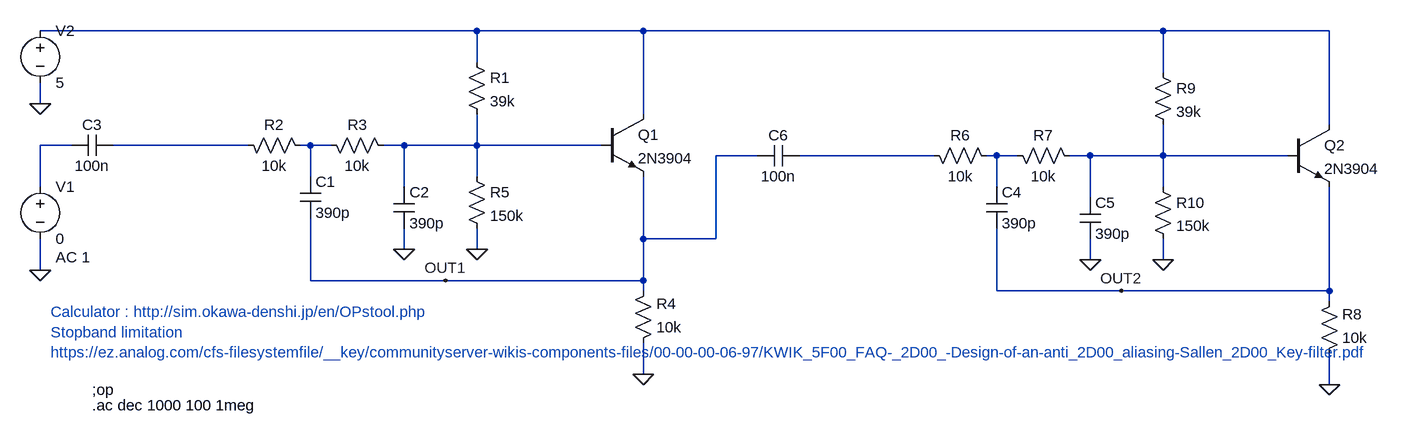
[diagram p0: schematic filter4.asc]
filter4.asc, the LTspice schematic file:
Version 4
SHEET 1 2504 680
WIRE 592 -176 -80 -176
WIRE 848 -176 592 -176
WIRE 1648 -176 848 -176
WIRE 1904 -176 1648 -176
WIRE 592 -128 592 -176
WIRE 1648 -112 1648 -176
WIRE -80 -64 -80 -96
WIRE 848 -48 848 -176
WIRE 1904 -32 1904 -176
WIRE -32 0 -80 0
WIRE 240 0 32 0
WIRE 336 0 320 0
WIRE 368 0 336 0
WIRE 480 0 448 0
WIRE 592 0 592 -48
WIRE 592 0 480 0
WIRE 784 0 592 0
WIRE 1024 16 960 16
WIRE 1296 16 1088 16
WIRE 1392 16 1376 16
WIRE 1424 16 1392 16
WIRE 1536 16 1504 16
WIRE 1648 16 1648 -32
WIRE 1648 16 1536 16
WIRE 1840 16 1648 16
WIRE 336 48 336 0
WIRE 592 48 592 0
WIRE -80 64 -80 0
WIRE 480 64 480 0
WIRE 1392 64 1392 16
WIRE 1648 64 1648 16
WIRE 1536 80 1536 16
WIRE 848 144 848 48
WIRE 960 144 960 16
WIRE 960 144 848 144
WIRE 480 160 480 128
WIRE 592 160 592 128
WIRE 1536 176 1536 144
WIRE 1648 176 1648 144
WIRE -80 192 -80 144
WIRE 336 208 336 112
WIRE 544 208 336 208
WIRE 848 208 848 144
WIRE 848 208 544 208
WIRE 848 224 848 208
WIRE 1392 224 1392 128
WIRE 1584 224 1392 224
WIRE 1904 224 1904 64
WIRE 1904 224 1584 224
WIRE 1904 240 1904 224
WIRE 848 352 848 304
WIRE 1904 368 1904 320
FLAG -80 -64 0
FLAG -80 192 0
FLAG 480 160 0
FLAG 848 352 0
FLAG 592 160 0
FLAG 1536 176 0
FLAG 1904 368 0
FLAG 1648 176 0
FLAG 544 208 OUT1
FLAG 1584 224 OUT2
DATAFLAG 736 208 ""
DATAFLAG 160 0 ""
DATAFLAG 1792 224 ""
DATAFLAG 1216 16 ""
DATAFLAG 672 0 ""
DATAFLAG 1760 16 ""
SYMBOL voltage -80 48 R0
WINDOW 123 24 124 Left 2
WINDOW 39 0 0 Left 0
SYMATTR Value2 AC 1
SYMATTR InstName V1
SYMATTR Value 0
SYMBOL npn 784 -48 R0
SYMATTR InstName Q1
SYMATTR Value 2N3904
SYMBOL res 224 -16 M90
WINDOW 0 0 56 VBottom 2
WINDOW 3 32 56 VTop 2
SYMATTR InstName R2
SYMATTR Value 10k
SYMBOL res 352 -16 M90
WINDOW 0 0 56 VBottom 2
WINDOW 3 32 56 VTop 2
SYMATTR InstName R3
SYMATTR Value 10k
SYMBOL res 832 320 M180
WINDOW 0 36 76 Left 2
WINDOW 3 36 40 Left 2
SYMATTR InstName R4
SYMATTR Value 10k
SYMBOL cap 320 48 R0
SYMATTR InstName C1
SYMATTR Value 390p
SYMBOL cap 464 64 R0
SYMATTR InstName C2
SYMATTR Value 390p
SYMBOL voltage -80 -192 R0
SYMATTR InstName V2
SYMATTR Value 5
SYMBOL res 576 -144 R0
SYMATTR InstName R1
SYMATTR Value 39k
SYMBOL res 576 32 R0
SYMATTR InstName R5
SYMATTR Value 150k
SYMBOL cap 32 -16 R90
WINDOW 0 0 32 VBottom 2
WINDOW 3 32 32 VTop 2
SYMATTR InstName C3
SYMATTR Value 100n
SYMBOL npn 1840 -32 R0
SYMATTR InstName Q2
SYMATTR Value 2N3904
SYMBOL res 1280 0 M90
WINDOW 0 0 56 VBottom 2
WINDOW 3 32 56 VTop 2
SYMATTR InstName R6
SYMATTR Value 10k
SYMBOL res 1408 0 M90
WINDOW 0 0 56 VBottom 2
WINDOW 3 32 56 VTop 2
SYMATTR InstName R7
SYMATTR Value 10k
SYMBOL res 1888 336 M180
WINDOW 0 36 76 Left 2
WINDOW 3 36 40 Left 2
SYMATTR InstName R8
SYMATTR Value 10k
SYMBOL cap 1376 64 R0
SYMATTR InstName C4
SYMATTR Value 390p
SYMBOL cap 1520 80 R0
SYMATTR InstName C5
SYMATTR Value 390p
SYMBOL res 1632 -128 R0
SYMATTR InstName R9
SYMATTR Value 39k
SYMBOL res 1632 48 R0
SYMATTR InstName R10
SYMATTR Value 150k
SYMBOL cap 1088 0 R90
WINDOW 0 0 32 VBottom 2
WINDOW 3 32 32 VTop 2
SYMATTR InstName C6
SYMATTR Value 100n
TEXT 0 376 Left 2 !;op
TEXT 0 400 Left 2 !.ac dec 1000 100 1meg
TEXT -64 256 Left 2 ;Calculator : http://sim.okawa-denshi.jp/en/OPstool.php\nStopband limitation\nhttps://ez.analog.com/cfs-filesystemfile/__key/communityserver-wikis-components-files/00-00-00-06-97/KWIK_5F00_FAQ-_2D00_-Design-of-an-anti_2D00_aliasing-Sallen_2D00_Key-filter.pdf

The netlist it stands for:
* filter4.asc
V1 N002 0 0 AC 1
Q1 N001 N005 OUT1 0 2N3904
R2 N003 N004 10k
R3 N004 N005 10k
R4 0 OUT1 10k
C1 N004 OUT1 390p
C2 N005 0 390p
V2 N001 0 5
R1 N001 N005 39k
R5 N005 0 150k
C3 N003 N002 100n
Q2 N001 N008 OUT2 0 2N3904
R6 N006 N007 10k
R7 N007 N008 10k
R8 0 OUT2 10k
C4 N007 OUT2 390p
C5 N008 0 390p
R9 N001 N008 39k
R10 N008 0 150k
C6 N006 OUT1 100n
.model NPN NPN
.model PNP PNP
.lib standard.bjt
;op
.ac dec 1000 100 1meg
* Calculator : http://sim.okawa-denshi.jp/en/OPstool.php
* Stopband limitation
* https://ez.analog.com/cfs-filesystemfile/__key/communityserver-wikis-components-files/00-00-00-06-97/KWIK_5F00_FAQ-_2D00_-Design-of-an-anti_2D00_aliasing-Sallen_2D00_Key-filter.pdf
.backanno
.end